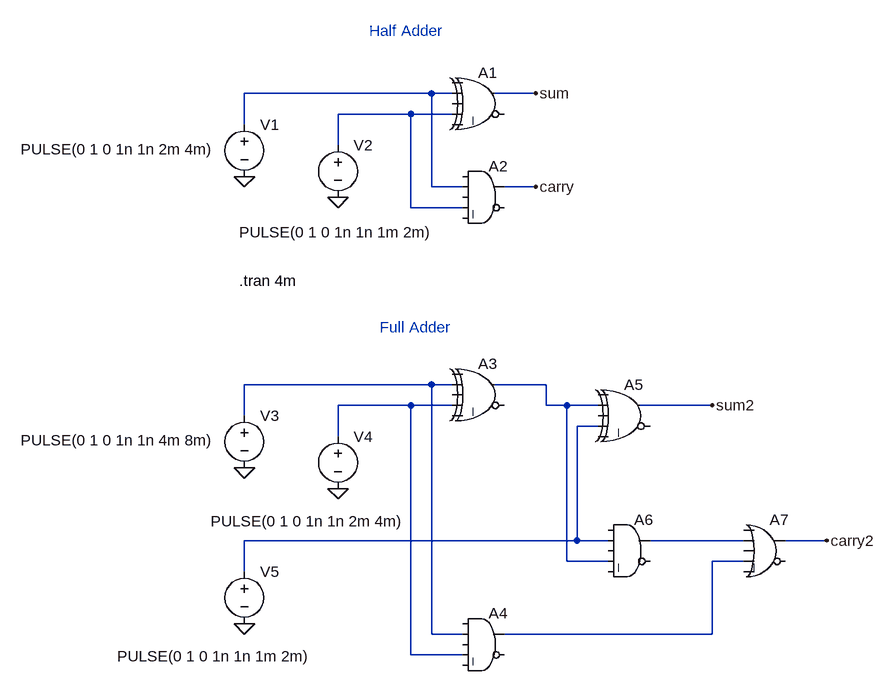
[diagram p0: schematic Half Adder and Full Adder.asc]
Half Adder and Full Adder.asc, the LTspice schematic file:
Version 4
SHEET 1 880 1032
WIRE 96 80 -192 80
WIRE 128 80 96 80
WIRE 256 80 192 80
WIRE 64 112 -48 112
WIRE 128 112 64 112
WIRE -192 128 -192 80
WIRE -48 160 -48 112
WIRE 96 224 96 80
WIRE 144 224 96 224
WIRE 256 224 208 224
WIRE 64 256 64 112
WIRE 144 256 64 256
WIRE 96 528 -192 528
WIRE 128 528 96 528
WIRE 272 528 192 528
WIRE 64 560 -48 560
WIRE 128 560 64 560
WIRE 272 560 272 528
WIRE 304 560 272 560
WIRE 352 560 304 560
WIRE 528 560 416 560
WIRE -192 576 -192 528
WIRE 352 592 320 592
WIRE -48 608 -48 560
WIRE 320 768 320 592
WIRE 320 768 -192 768
WIRE 368 768 320 768
WIRE 576 768 432 768
WIRE 704 768 640 768
WIRE 304 800 304 560
WIRE 368 800 304 800
WIRE 576 800 528 800
WIRE -192 816 -192 768
WIRE 96 912 96 528
WIRE 144 912 96 912
WIRE 528 912 528 800
WIRE 528 912 208 912
WIRE 64 944 64 560
WIRE 144 944 64 944
FLAG 256 80 sum
FLAG 256 224 carry
FLAG -192 208 0
FLAG -48 240 0
FLAG -192 656 0
FLAG -48 688 0
FLAG -192 896 0
FLAG 528 560 sum2
FLAG 704 768 carry2
SYMBOL Digital\\xor 176 32 R0
SYMATTR InstName A1
SYMBOL Digital\\and 176 176 R0
SYMATTR InstName A2
SYMBOL Digital\\xor 176 480 R0
SYMATTR InstName A3
SYMBOL Digital\\and 176 864 R0
SYMATTR InstName A4
SYMBOL voltage -192 560 R0
WINDOW 3 -344 54 Left 2
WINDOW 123 0 0 Left 2
WINDOW 39 0 0 Left 2
SYMATTR InstName V3
SYMATTR Value PULSE(0 1 0 1n 1n 4m 8m)
SYMBOL Digital\\xor 400 512 R0
SYMATTR InstName A5
SYMBOL Digital\\and 400 720 R0
SYMATTR InstName A6
SYMBOL voltage -48 592 R0
WINDOW 3 -196 146 Left 2
WINDOW 123 0 0 Left 2
WINDOW 39 0 0 Left 2
SYMATTR InstName V4
SYMATTR Value PULSE(0 1 0 1n 1n 2m 4m)
SYMBOL Digital\\or 608 720 R0
SYMATTR InstName A7
SYMBOL voltage -192 112 R0
WINDOW 3 -344 54 Left 2
WINDOW 123 0 0 Left 2
WINDOW 39 0 0 Left 2
SYMATTR InstName V1
SYMATTR Value PULSE(0 1 0 1n 1n 2m 4m)
SYMBOL voltage -48 144 R0
WINDOW 3 -152 150 Left 2
WINDOW 123 0 0 Left 2
WINDOW 39 0 0 Left 2
SYMATTR InstName V2
SYMATTR Value PULSE(0 1 0 1n 1n 1m 2m)
SYMBOL voltage -192 800 R0
WINDOW 3 -196 146 Left 2
WINDOW 123 0 0 Left 2
WINDOW 39 0 0 Left 2
SYMATTR InstName V5
SYMATTR Value PULSE(0 1 0 1n 1n 1m 2m)
TEXT 0 -16 Left 2 ;Half Adder
TEXT 16 440 Left 2 ;Full Adder
TEXT -200 368 Left 2 !.tran 4m

The netlist it stands for:
* Half Adder and Full Adder.asc
A1 0 N001 0 N002 0 0 sum 0 XOR
A2 0 N001 0 N002 0 0 carry 0 AND
A3 0 N003 0 N005 0 0 N004 0 XOR
A4 0 N003 0 N005 0 0 N008 0 AND
V3 N003 0 PULSE(0 1 0 1n 1n 4m 8m)
A5 0 N004 0 N006 0 0 sum2 0 XOR
A6 0 N006 0 N004 0 0 N007 0 AND
V4 N005 0 PULSE(0 1 0 1n 1n 2m 4m)
A7 0 N007 0 N008 0 0 carry2 0 OR
V1 N001 0 PULSE(0 1 0 1n 1n 2m 4m)
V2 N002 0 PULSE(0 1 0 1n 1n 1m 2m)
V5 N006 0 PULSE(0 1 0 1n 1n 1m 2m)
* Half Adder
* Full Adder
.tran 4m
.backanno
.end